# Altium schematic sheet 1166V31-2.SchDoc: Half-Bridge Phase 1
size A3; Author: M. Kutzsche; Organization: Kübrich Ing.-Gesellschaft; Address1: mbH & Co. KG; Address2: Weißmühle 10; Address3: D-96170 Priesendorf; DocumentNumber: UltraZohm; Revision: 31; SheetNumber: 2; SheetTotal: 5
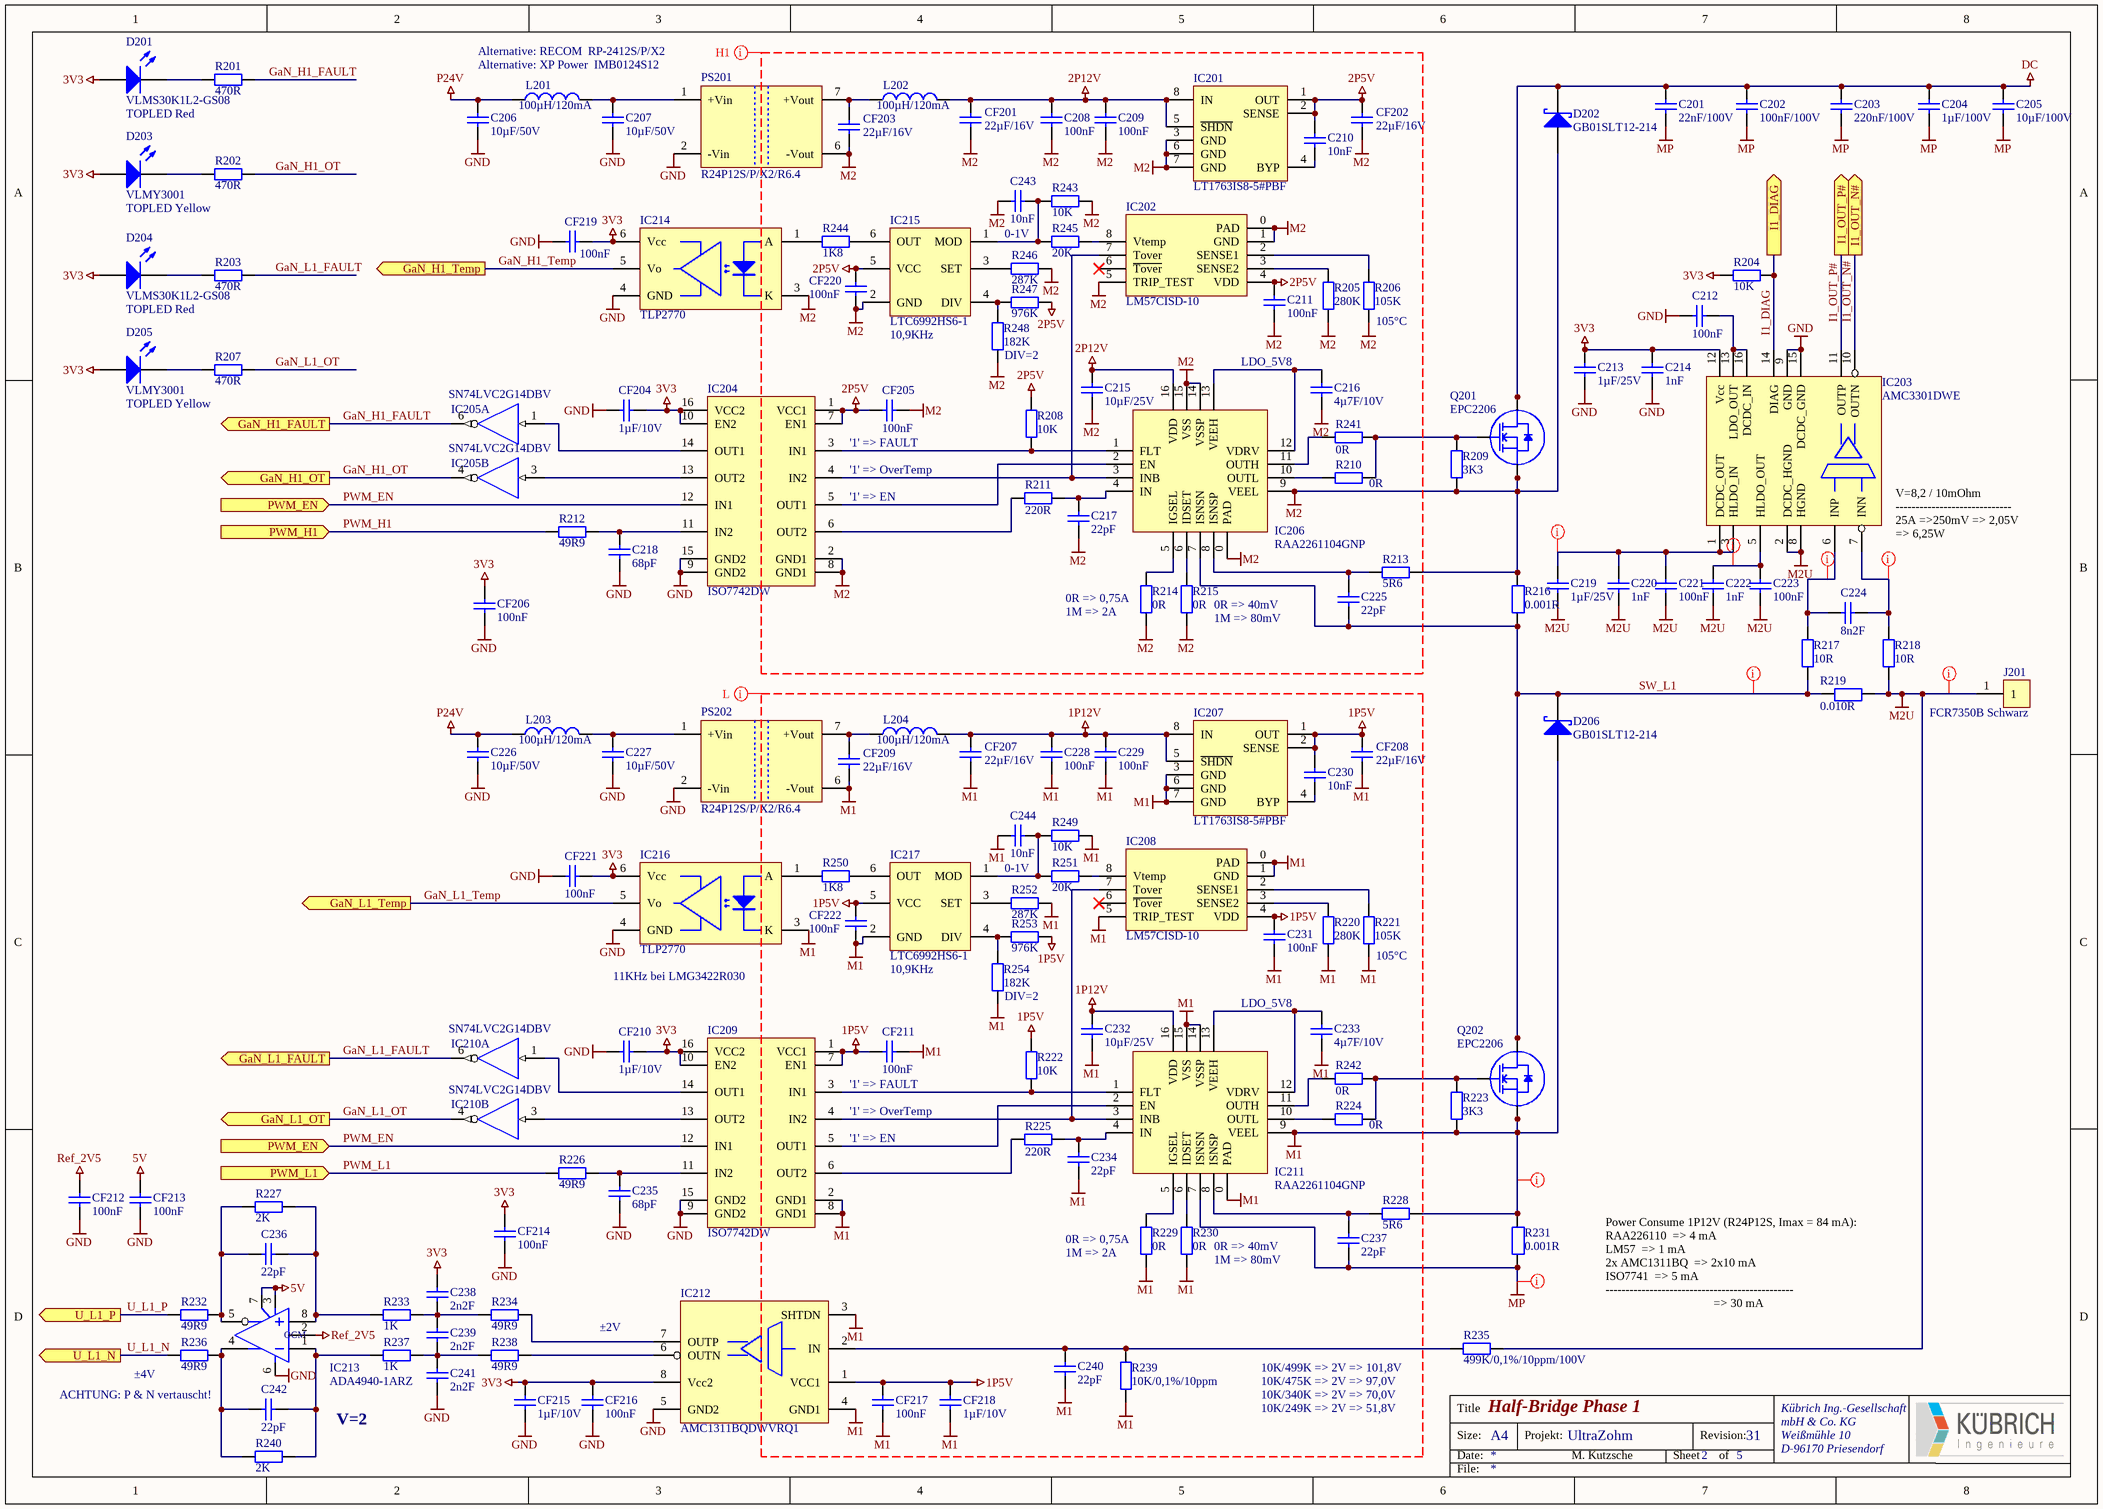
[diagram p0: 1166V31-2.SchDoc]

## Parts
C201  22nF/100V  [0805-Cap]
C202  100nF/100V  [0805-Cap]
C203  220nF/100V  [0805-Cap]
C204  1µF/100V  [0805-Cap]
C205  10µF/100V  [1210-Cap]
C206  10µF/50V  [1206-Cap]
C207  10µF/50V  [1206-Cap]
C208  100nF  [0603-Cap]
C209  100nF  [0603-Cap]
C210  10nF  [0603-Cap]
C211  100nF  [0603-Cap]
C212  100nF  [0603-Cap]
C213  1µF/25V  [1206-Cap]
C214  1nF  [1206-Cap]
C215  10µF/25V  [0805-Cap]
C216  4µ7F/10V  [0805-Cap]
C217  22pF  [0603-Cap]
C218  68pF  [0603-Cap]
C219  1µF/25V  [0603-Cap]
C220  1nF  [0603-Cap]
C221  100nF  [0603-Cap]
C222  1nF  [1206-Cap]
C223  100nF  [1206-Cap]
C224  8n2F  [0603-Cap]
C225  22pF  [0603-Cap]
C226  10µF/50V  [1206-Cap]
C227  10µF/50V  [1206-Cap]
C228  100nF  [0603-Cap]
C229  100nF  [0603-Cap]
C230  10nF  [0603-Cap]
C231  100nF  [0603-Cap]
C232  10µF/25V  [0805-Cap]
C233  4µ7F/10V  [0805-Cap]
C234  22pF  [0603-Cap]
C235  68pF  [0603-Cap]
C236  22pF  [0603-Cap]
C237  22pF  [0603-Cap]
C238  2n2F  [0603-Cap]
C239  2n2F  [0603-Cap]
C240  22pF  [0603-Cap]
C241  2n2F  [0603-Cap]
C242  22pF  [0603-Cap]
C243  10nF  [0603-Cap]
C244  10nF  [0603-Cap]
CF201  22µF/16V  [0805-Cap]
CF202  22µF/16V  [0805-Cap]
CF203  22µF/16V  [0805-Cap]
CF204  1µF/10V  [0603-Cap]
CF205  100nF  [0603-Cap]
CF206  100nF  [0603-Cap]
CF207  22µF/16V  [0805-Cap]
CF208  22µF/16V  [0805-Cap]
CF209  22µF/16V  [0805-Cap]
CF210  1µF/10V  [0603-Cap]
CF211  100nF  [0603-Cap]
CF212  100nF  [0603-Cap]
CF213  100nF  [0603-Cap]
CF214  100nF  [0603-Cap]
CF215  1µF/10V  [0603-Cap]
CF216  100nF  [0603-Cap]
CF217  100nF  [0603-Cap]
CF218  1µF/10V  [0603-Cap]
CF219  100nF  [0603-Cap]
CF220  100nF  [0603-Cap]
CF221  100nF  [0603-Cap]
CF222  100nF  [0603-Cap]
D201  VLMS30K1L2-GS08  Class II: TOPLED Red  [PLCC-2_rot]
D202  GB01SLT12-214  [DO-214 (SMB)]
D203  VLMY3001  Class II: TOPLED Yellow  [PLCC-2_gelb]
D204  VLMS30K1L2-GS08  Class II: TOPLED Red  [PLCC-2_rot]
D205  VLMY3001  Class II: TOPLED Yellow  [PLCC-2_gelb]
D206  GB01SLT12-214  [DO-214 (SMB)]
IC201  LT1763IS8-5#PBF  [SOIC-8-N]
IC202  LM57CISD-10  [WSON-8 (2.5x2.5mm)]
IC203  AMC3301DWE  [SOIC-16-W - 8.1mm]
IC204  ISO7742DW  [SOIC-16-W - 8.1mm]
IC205  SN74LVC2G14DBV  [SOT-23-6]  (parts A,B of 2)
IC206  RAA2261104GNP  [QFN-16 (4x4mm)]
IC207  LT1763IS8-5#PBF  [SOIC-8-N]
IC208  LM57CISD-10  [WSON-8 (2.5x2.5mm)]
IC209  ISO7742DW  [SOIC-16-W - 8.1mm]
IC210  SN74LVC2G14DBV  [SOT-23-6]  (parts A,B of 2)
IC211  RAA2261104GNP  [QFN-16 (4x4mm)]
IC212  AMC1311BQDWVRQ1  [SOIC-8-W]
IC213  ADA4940-1ARZ  [SOIC-8-N]
IC214  TLP2770  [SO-6L]
IC215  LTC6992HS6-1  [SOT-23-6]
IC216  TLP2770  [SO-6L]
IC217  LTC6992HS6-1  [SOT-23-6]
J201  FCR7350B Schwarz  [SLB4-I/90 - 4mm - Schwarz - CLIFF]
L201  100µH/120mA  [1007-IND (2518)]
L202  100µH/120mA  [1007-IND (2518)]
L203  100µH/120mA  [1007-IND (2518)]
L204  100µH/120mA  [1007-IND (2518)]
PS201  R24P12S/P/X2/R6.4  [SIP-7 Single - X2]
PS202  R24P12S/P/X2/R6.4  [SIP-7 Single - X2]
Q201  EPC2206  [D0232]
Q202  EPC2206  [D0232]
R201  470R  [0603-Res]
R202  470R  [0603-Res]
R203  470R  [0603-Res]
R204  10K  [0603-Res]
R205  280K  [0603-Res]
R206  105K  [0603-Res]
R207  470R  [0603-Res]
R208  10K  [0603-Res]
R209  3K3  [0603-Res]
R210  0R  [0603-Res]
R211  220R  [0603-Res]
R212  49R9  [0603-Res]
R213  5R6  [0603-Res]
R214  0R  [0603-Res]
R215  0R  [0603-Res]
R216  0.001R  [2512]
R217  10R  [0603-Res]
R218  10R  [0603-Res]
R219  0.010R  [GMR320]
R220  280K  [0603-Res]
R221  105K  [0603-Res]
R222  10K  [0603-Res]
R223  3K3  [0603-Res]
R224  0R  [0603-Res]
R225  220R  [0603-Res]
R226  49R9  [0603-Res]
R227  2K  [0603-Res]
R228  5R6  [0603-Res]
R229  0R  [0603-Res]
R230  0R  [0603-Res]
R231  0.001R  [2512]
R232  49R9  [0603-Res]
R233  1K  [0603-Res]
R234  49R9  [0603-Res]
R235  499K/0,1%/10ppm/100V  [0805-Res]
R236  49R9  [0603-Res]
R237  1K  [0603-Res]
R238  49R9  [0603-Res]
R239  10K/0,1%/10ppm  [0603-Res]
R240  2K  [0603-Res]
R241  0R  [0603-Res]
R242  0R  [0603-Res]
R243  10K  [0603-Res]
R244  1K8  [0603-Res]
R245  20K  [0603-Res]
R246  287K  [0603-Res]
R247  976K  [0603-Res]
R248  182K  [0603-Res]
R249  10K  [0603-Res]
R250  1K8  [0603-Res]
R251  20K  [0603-Res]
R252  287K  [0603-Res]
R253  976K  [0603-Res]
R254  182K  [0603-Res]

## Ports
GaN_H1_FAULT (out), GaN_H1_OT (out), GaN_H1_Temp (out), GaN_L1_FAULT (out), GaN_L1_OT (out), GaN_L1_Temp (out), I1_DIAG (out), I1_OUT_N# (out), I1_OUT_P# (out), PWM_EN (in), PWM_H1 (in), PWM_L1 (in), U_L1_N (out), U_L1_P (out)

## Nets
1P5V: C230.1 C231.1 CF208.1 CF211.2 CF217.1 CF218.1 CF222.1 IC207.1(OUT) IC207.2(SENSE) IC208.4(VDD) IC209.1(VCC1) IC209.7(EN1) IC212.1(VCC1) IC217.5(VCC) R222.1 R253.1
1P12V: C228.1 C229.1 C232.2 CF207.1 IC207.5(~{SHDN}) IC207.8(IN) IC211.16(VDD) L204.2
2P5V: C210.1 C211.1 CF202.1 CF205.2 CF220.1 IC201.1(OUT) IC201.2(SENSE) IC202.4(VDD) IC204.1(VCC1) IC204.7(EN1) IC215.5(VCC) R208.1 R247.1
2P12V: C208.1 C209.1 C215.2 CF201.1 IC201.5(~{SHDN}) IC201.8(IN) IC206.16(VDD) L202.2
3V3: C213.1 C214.1 C238.2 CF204.1 CF206.1 CF210.1 CF214.1 CF215.1 CF216.1 CF219.2 CF221.2 D201.1(A) D203.1(A) D204.1(A) D205.1(A) IC203.12(Vcc) IC204.10(EN2) IC204.16(VCC2) IC209.10(EN2) IC209.16(VCC2) IC212.8(Vcc2) IC214.6(Vcc) IC216.6(Vcc) R204.2
5V: CF213.1 IC213.3(V+) IC213.7(EN)
DC: C201.1 C202.1 C203.1 C204.1 C205.1 D202.2(K) Q201.3(D1) Q201.4(D2) Q201.7(D3) Q201.8(D4) Q201.11(D5) Q201.12(D6) Q201.15(D7) Q201.16(D8) Q201.19(D9) Q201.20(D10) Q201.23(D11) Q201.24(D12) Q201.27(D13) Q201.28(D14)
GND: C206.1 C207.1 C212.1 C213.2 C214.2 C218.1 C226.1 C227.1 C235.1 C241.1 CF204.2 CF206.2 CF210.2 CF212.2 CF213.2 CF214.2 CF215.2 CF216.2 CF219.1 CF221.1 IC203.9(GND) IC203.15(DCDC_GND) IC204.9(GND2) IC204.15(GND2) IC205.2(GND) IC209.9(GND2) IC209.15(GND2) IC210.2(GND) IC212.5(GND2) IC213.6(V-) IC214.4(GND) IC216.4(GND) PS201.2(-Vin) PS202.2(-Vin)
M1: C228.2 C229.2 C231.2 C232.1 C233.2 C234.1 C240.1 C244.1 CF207.2 CF208.2 CF209.2 CF211.1 CF217.2 CF218.2 CF222.2 D206.1(A) IC207.3(GND) IC207.6(GND) IC207.7(GND) IC208.0(PAD) IC208.1(GND) IC208.5(TRIP_TEST) IC209.2(GND1) IC209.8(GND1) IC211.0(PAD) IC211.9(VEEL) IC211.14(VSSP) IC211.15(VSS) IC212.3(SHTDN) IC212.4(GND1) IC216.3(K) IC217.2(GND) PS202.6(-Vout) Q202.2(S1) Q202.5(S2) Q202.6(S3) Q202.9(S4) Q202.10(S5) Q202.13(S6) Q202.14(S7) Q202.17(S8) Q202.18(S9) Q202.21(S10) Q202.22(S11) Q202.25(S12) Q202.26(S13) Q202.29(S14) Q202.30(Sub) R220.2 R221.2 R223.1 R228.2 R229.2 R230.2 R231.2 R239.2 R249.1 R252.1 R254.1
M2: C208.2 C209.2 C211.2 C215.1 C216.2 C217.1 C243.1 CF201.2 CF202.2 CF203.2 CF205.1 CF220.2 D202.1(A) IC201.3(GND) IC201.6(GND) IC201.7(GND) IC202.0(PAD) IC202.1(GND) IC202.5(TRIP_TEST) IC204.2(GND1) IC204.8(GND1) IC206.0(PAD) IC206.9(VEEL) IC206.14(VSSP) IC206.15(VSS) IC214.3(K) IC215.2(GND) PS201.6(-Vout) Q201.2(S1) Q201.5(S2) Q201.6(S3) Q201.9(S4) Q201.10(S5) Q201.13(S6) Q201.14(S7) Q201.17(S8) Q201.18(S9) Q201.21(S10) Q201.22(S11) Q201.25(S12) Q201.26(S13) Q201.29(S14) Q201.30(Sub) R205.2 R206.2 R209.1 R213.2 R214.2 R215.2 R216.2 R243.1 R246.1 R248.1
M2U: C219.2 C220.2 C221.2 C222.2 C223.2 IC203.2(DCDC_HGND) IC203.8(HGND) J201.1 R218.1 R219.1 R235.2
MP: C201.2 C202.2 C203.2 C204.2 C205.2 C237.1 IC211.7(ISNSN) R231.1
P24V: C206.2 C226.2 L201.1 L203.1
Ref_2V5: CF212.1 IC213.2(OCM)
VCC: IC205.5(VCC) IC210.5(VCC)
GaN_H1_FAULT: IC205.6(1Y) R201.2 ; port GaN_H1_FAULT
GaN_H1_OT: IC205.4(2Y) R202.2 ; port GaN_H1_OT
GaN_H1_Temp: IC214.5(Vo) ; port GaN_H1_Temp
GaN_L1_FAULT: IC210.6(1Y) R203.2 ; port GaN_L1_FAULT
GaN_L1_OT: IC210.4(2Y) R207.2 ; port GaN_L1_OT
GaN_L1_Temp: IC216.5(Vo) ; port GaN_L1_Temp
I1_DIAG: IC203.14(DIAG) R204.1 ; port I1_DIAG
I1_OUT_N#: IC203.10(OUTN) ; port I1_OUT_N#
I1_OUT_P#: IC203.11(OUTP) ; port I1_OUT_P#
PWM_EN: IC204.12(IN1) IC209.12(IN1) ; port PWM_EN
PWM_H1: R212.2 ; port PWM_H1
PWM_L1: R226.2 ; port PWM_L1
SW_L1: C225.1 D206.2(K) IC206.7(ISNSN) Q202.3(D1) Q202.4(D2) Q202.7(D3) Q202.8(D4) Q202.11(D5) Q202.12(D6) Q202.15(D7) Q202.16(D8) Q202.19(D9) Q202.20(D10) Q202.23(D11) Q202.24(D12) Q202.27(D13) Q202.28(D14) R216.1 R217.1 R219.2
U_L1_N: R236.2 ; port U_L1_N
U_L1_P: R232.2 ; port U_L1_P
NetC207_2: C207.2 L201.2 PS201.1(+Vin)
NetC210_2: C210.2 IC201.4(BYP)
NetC212_2: C212.2 IC203.13(LDO_OUT) IC203.16(DCDC_IN)
NetC216_1: C216.1 IC206.12(VDRV) IC206.13(VEEH)
NetC217_2: C217.2 IC206.4(IN) R211.1
NetC218_2: C218.2 IC204.11(IN2) R212.1
NetC219_1: C219.1 C220.1 C221.1 IC203.1(DCDC_OUT) IC203.3(HLDO_IN)
NetC222_1: C222.1 C223.1 IC203.5(HLDO_OUT)
NetC224_1: C224.1 IC203.7(INN) R218.2
NetC224_2: C224.2 IC203.6(INP) R217.2
NetC225_2: C225.2 IC206.8(ISNSP) R213.1
NetC227_2: C227.2 L203.2 PS202.1(+Vin)
NetC230_2: C230.2 IC207.4(BYP)
NetC233_1: C233.1 IC211.12(VDRV) IC211.13(VEEH)
NetC234_2: C234.2 IC211.4(IN) R225.1
NetC235_2: C235.2 IC209.11(IN2) R226.1
NetC236_1: C236.1 IC213.8(+) R227.1 R233.2
NetC236_2: C236.2 IC213.5(Out) R227.2 R232.1
NetC237_2: C237.2 IC211.8(ISNSP) R228.1
NetC238_1: C238.1 C239.2 R233.1 R234.2
NetC239_1: C239.1 C241.2 R237.1 R238.2
NetC240_2: C240.2 IC212.2(IN) R235.1 R239.1
NetC242_1: C242.1 IC213.1(-) R237.2 R240.1
NetC242_2: C242.2 IC213.4(Out) R236.1 R240.2
NetC243_2: C243.2 IC215.1(MOD) R243.2 R245.1
NetC244_2: C244.2 IC217.1(MOD) R249.2 R251.1
NetCF203_1: CF203.1 L202.1 PS201.7(+Vout)
NetCF209_1: CF209.1 L204.1 PS202.7(+Vout)
NetD201_2: D201.2(K) R201.1
NetD203_2: D203.2(K) R202.1
NetD204_2: D204.2(K) R203.1
NetD205_2: D205.2(K) R207.1
NetIC202_2: IC202.2(SENSE1) R206.1
NetIC202_3: IC202.3(SENSE2) R205.1
NetIC202_7: IC202.7(Tover) IC204.4(IN2) IC206.3(INB)
NetIC202_8: IC202.8(Vtemp) R245.2
NetIC204_3: IC204.3(IN1) IC206.1(FLT) R208.2
NetIC204_5: IC204.5(OUT1) IC206.2(EN)
NetIC204_6: IC204.6(OUT2) R211.2
NetIC204_13: IC204.13(OUT2) IC205.3(2A)
NetIC204_14: IC204.14(OUT1) IC205.1(1A)
NetIC206_5: IC206.5(IGSEL) R214.1
NetIC206_6: IC206.6(IDSET) R215.1
NetIC206_10: IC206.10(OUTL) R210.1
NetIC206_11: IC206.11(OUTH) R241.1
NetIC208_2: IC208.2(SENSE1) R221.1
NetIC208_3: IC208.3(SENSE2) R220.1
NetIC208_7: IC208.7(Tover) IC209.4(IN2) IC211.3(INB)
NetIC208_8: IC208.8(Vtemp) R251.2
NetIC209_3: IC209.3(IN1) IC211.1(FLT) R222.2
NetIC209_5: IC209.5(OUT1) IC211.2(EN)
NetIC209_6: IC209.6(OUT2) R225.2
NetIC209_13: IC209.13(OUT2) IC210.3(2A)
NetIC209_14: IC209.14(OUT1) IC210.1(1A)
NetIC211_5: IC211.5(IGSEL) R229.1
NetIC211_6: IC211.6(IDSET) R230.1
NetIC211_10: IC211.10(OUTL) R224.1
NetIC211_11: IC211.11(OUTH) R242.1
NetIC212_6: IC212.6(OUTN) R238.1
NetIC212_7: IC212.7(OUTP) R234.1
NetIC214_1: IC214.1(A) R244.2
NetIC215_3: IC215.3(SET) R246.2
NetIC215_4: IC215.4(DIV) R247.2 R248.2
NetIC215_6: IC215.6(OUT) R244.1
NetIC216_1: IC216.1(A) R250.2
NetIC217_3: IC217.3(SET) R252.2
NetIC217_4: IC217.4(DIV) R253.2 R254.2
NetIC217_6: IC217.6(OUT) R250.1
NetQ201_1: Q201.1(G) R209.2 R210.2 R241.2
NetQ202_1: Q202.1(G) R223.2 R224.2 R242.2

Not connected (* = marked no-connect by the designer): IC202 6(~{Tover})*; IC208 6(~{Tover})*

## Layout directives
net class H1: 2P5V, 2P12V, M2, M2U, NetC219_1, NetC222_1, NetC224_1, NetC224_2, SW_L1
net class L: 1P5V, 1P12V, M1, MP

## Notes on the sheet
- Alternative: RECOM  RP-2412S/P/X2
- Alternative: XP Power  IMB0124S12
- 0-1V
- (near IC215) 10,9KHz
- (near R248) DIV=2
- LDO_5V8
- (near R206) 105°C
- '1' => FAULT
- '1' => OverTemp
- (near IC204) '1' => EN
- (near IC203) V=8,2 / 10mOhm
  -----------------------------
  25A =>250mV => 2,05V
  => 6,25W
- (near R214) 1M => 2A
- (near R214) 0R => 0,75A
- (near R215) 0R => 40mV
- (near R215) 1M => 80mV
- (near IC216) 11KHz bei LMG3422R030
- (near IC217) 10,9KHz
- (near R221) 105°C
- (near R254) DIV=2
- (near IC209) '1' => EN
- (near R229) 1M => 2A
- (near R229) 0R => 0,75A
- (near R230) 0R => 40mV
- (near R230) 1M => 80mV
- Power Consume 1P12V (R24P12S, Imax = 84 mA):
  RAA226110 	=> 4 mA
  LM57		=> 1 mA
  2x AMC1311BQ 	=> 2x10 mA
  ISO7741		=> 5 mA
  -----------------------------------------------
  => 30 mA
- ACHTUNG: P & N vertauscht!
- (near R236) ±4V
- ±2V
- 10K/499K => 2V => 101,8V
- 10K/475K => 2V => 97,0V
- 10K/340K => 2V => 70,0V
- V=2
- 10K/249K => 2V => 51,8V
- Title
- Size:
- Date:
- A4
- Projekt:
- Sheet
- Revision:
- of
- File:

## Library data of the parts
C201-C244 CF201-CF222 = Cap_SMD: Capacitor (SMD); Class I: Pasiv; Class II: Capacitor; Last edited: 20.11.2006 10:25
  C201: value: 22nF/100V
  C202: value: 100nF/100V
  C203: value: 220nF/100V
  C204: value: 1µF/100V
  C205: value: 10µF/100V
  C206 C207 C226 C227: value: 10µF/50V
  C208 C209 C211 C212 C221 C223 C228 C229 C231 CF205 CF206 CF211-CF214 CF216 CF217 CF219-CF222: value: 100nF
  C210 C230 C243 C244: value: 10nF
  C213 C219: value: 1µF/25V
  C214 C220 C222: value: 1nF
  C215 C232: value: 10µF/25V
  C216 C233: value: 4µ7F/10V
  C217 C225 C234 C236 C237 C240 C242: value: 22pF
  C218 C235: value: 68pF
  C224: value: 8n2F
  C238 C239 C241: value: 2n2F
  CF201-CF203 CF207-CF209: value: 22µF/16V
  CF204 CF210 CF215 CF218: value: 1µF/10V
D201 D204 = VLMS30K1L2-GS08: Top LED Super red, 2mA, 18mcd, -40-100°C; Manufacturer: Vishay; Class I: Discrete; Best.-Nr.: Farnell 132-8349; Last edited: 23.01.2007 08:58
D202 D206 = GB01SLT12-214: Silicon Carbide Schottky Diode Vr=1200V If=1A; Manufacturer: GeneSiC Semiconductor; Class I: Discret; Package information: Unknown; Best.-Nr.: DigiKey: 1242-1169-1-ND; Class II: Silicon Carbide Schottky Diode Vr=1200V If=1A; Datasheet: Ver. 7 Nov 2000; Package reference: DO-214AA (SMB)
D203 D205 = VLMY3001: Top LED Yellow, 2mA, 18mcd, -40-100°C; Manufacturer: Vishay; Class I: Discrete; Best.-Nr.: ???; Last edited: 23.01.2007 08:58
IC201 IC207 = LT1763IS8-5#PBF: LDO 5V/500mA, Vin 20V (-40-125°C); Manufacturer: Linear Technology; Class I: Discret; Package information: Unknown; Best.-Nr.: Farnell 229-5214; Class II: LDO 5V/500mA, Vin 20V (-40-125°C); Datasheet: ???; Package reference: SO-8
IC202 IC208 = LM57CISD-10: Temperature Sensor/Switch -40 - 150°C, Resistor-Programmable, 10°C Hysterese; Manufacturer: Texas Instruments; Class I: Sensor; Best.-Nr.: DigiKey: LM57CISD-10/NOPBCT-ND; Class II: Temperature Sensor/Switch -40 - 150°C, Resistor-Programmable, 10°C Hysterese
IC203 = AMC3301DWE: ±250 mV Input Voltage Range, Reinforced Isolated Amplifier and High Bandwidth of 300 kHz; Manufacturer: Texas Instruments; Class II: ±250 mV, 300KHz, -40-125°C; Package information: Unknown; Best.-Nr.: DigiKey: 296-AMC3301DWE-ND; Class I: Isolated Amplifier; Datasheet: Unknown; Package reference: SOIC-16-W
IC204 IC209 = ISO7742DW: Quad-CH 100Mbps Isolators 2 IN/2 OUT, 5000V Reinforced, (-40-125°C); Manufacturer: Texas Instruments; Class I: Optocoupler; Package information: Unknown; Best.-Nr.: DigiKey: 296-44609-1-ND; Class II: Quad-CH 100Mbps Isolators 2 IN/2 OUT, 5000V Reinforced, (-40-125°C); Datasheet: Unknown; Package reference: SOIC-16W
IC205 IC210 = SN74LVC2G14D_: Dual Inverter with Schmitt Trigger Input; Manufacturer: Texas Instrument; Class I: Logic; value121: SN74LVC2G14DCK; Datasheet: SCES200J; Class II: Dual Inverter with Schmitt Trigger Input; value111: SN74LVC2G14DBV; Last edited: 22.01.2007 11:08
IC206 IC211 = RAA2261104GNP: Low -Side GaN FET-Driver, 6,5V - 18V; Manufacturer: Renesas; Class I: Discret; Package information: Unknown; Best.-Nr.: Mouser: 968-2261104GNP#AA0; Class II: Low -Side GaN FET-Driver, 6,5V - 18V; Datasheet: Rev. Mar 2002; Package reference: QFN-16
IC212 = AMC1311BQDWVRQ1: 2V Input, Automotive High-Impedance, Reinforced Isolated Amplifier for Voltage Sensing; Manufacturer: Texas Instruments; Class II: 2V, 275KHz, -40-125°C; Package information: Unknown; Best.-Nr.: Mouser: 595-AMC1311BQDWVRQ1; Class I: Isolated Amplifier; Datasheet: Unknown; Package reference: SOIC-8-W
IC213 = ADA4940-1ARZ: Fully Differential ADC Drivers (-40-125°C); Manufacturer: ANALOG DEVICES; Class I: Analog; Best.-Nr.: Farnell 209-6178; Class II: Fully Differential ADC Drivers (-40-125°C); Datasheet: DSO11449, Ver. Aug 2000; Last edited: 04.01.2007 10:14; Package Reference: SOIC-N-8
IC214 IC216 = TLP2770: High-speed 20Mbps Logic Gate Optocoupler; Manufacturer: Toshiba; Package information: Unknown; Best.-Nr.: DigiKey: TLP2770; Class II: High-speed 20Mbps Logic Gate Optocoupler; Class I: Optocoupler; Package reference: SO-6L
IC215 IC217 = LTC6992HS6-1: Analog to PWM Converter 0-100%, -40-125°C; Manufacturer: Analog Device; Best.-Nr.: Mouser: 584-C6992HS6-1TRMPBF; Published: 24-Mar-1999; Revision: July-2002: Re-released for DXP Platform.; Publisher: Altium Limited
J201 = FCR7350B Schwarz: Labor Winkelbuchsen 4mm Schwarz; Manufacturer: CLIFF Electronic; Class I: Connectors; Best.-Nr.: Farnell: 185-4507; Class II: Labor Winkelbuchsen 4mm Schwarz; Last edited: 07.03.2007 13:28
L201-L204 = CB2518T101K: 100µH, 60/120mA. (1007), -40-105°C; Manufacturer: Taiyo Yuden; Class I: Pasive; Best.-Nr.: DigiKey:   587-2192-1-ND; Class II: 100µH, 60/120mA. (1007), -40-105°C; Last edited: 08.12.2006 12:28
PS201 PS202 = R24P12S/P/X2/R6.4: DC/DC Converter 24V to 12V, 1W, 84mA (unregulated) 6,4KVDC Rainforced; Manufacturer: Recom; Class I: Analog; Package information: Unknown; Best.-Nr.: Mouser: 919-R24P12SX2PR6.4; Class II: DC/DC Converter 24V to 12V, 1W, 84mA (unregulated) 6,4KVDC Rainforced; Package reference: SIP-7; Datasheet: Rev. 28 Apr 2002
Q201 Q202 = EPC2206: GaN-Fet 80V, 2.2mOhm, 90A; Manufacturer: EPC; Class I: Discret; Package information: Unknown; Best.-Nr.: DigiKey: 917-1212-1-ND; Class II: GaN-Fet 80V, 2.2mOhm, 90A; Datasheet: Rev. Mar 2002; Package reference: DIE
R201-R215 R217 R218 R220-R230 R232-R254 = Res_SMD: Resistor SMD; Class I: Pasiv; Class II: Resistor; Last edited: 17.11.2006 11:38
  R201-R203 R207: value: 470R
  R204 R208 R222 R243 R249: value: 10K
  R205 R220: value: 280K
  R206 R221: value: 105K
  R209 R223: value: 3K3
  R210 R214 R215 R224 R229 R230 R241 R242: value: 0R
  R211 R225: value: 220R
  R212 R226 R232 R234 R236 R238: value: 49R9
  R213 R228: value: 5R6
  R217 R218: value: 10R
  R227 R240: value: 2K
  R233 R237: value: 1K
  R235: value: 499K/0,1%/10ppm/100V
  R239: value: 10K/0,1%/10ppm
  R244 R250: value: 1K8
  R245 R251: value: 20K
  R246 R252: value: 287K
  R247 R253: value: 976K
  R248 R254: value: 182K
R216 R231 = CSS2H-2512R-1L00F: Shunt 0.001R, 5W, 1%, 50ppm/°C; Manufacturer: Bourns; Class I: Pasiv; Class II: Shunt 5W; Best.-Nr.: Farnell 257-6347; Last edited: 23.11.2010 14:12; value: 0.001R
R219 = GMR320HJBFA10L0: Shunt 0.010R, 10W, 1%, 25ppm; Manufacturer: ROHM; Class I: Pasiv; Class II: Shunt 10W; Best.-Nr.: DigiKey 511-GMR320HJBFA10L0CT-ND; Mouser: 755-GMR320HJBFA10L0; Last edited: 23.11.2006 14:12; value: 0.010R